# Altium schematic sheet DSI.SchDoc
size A4
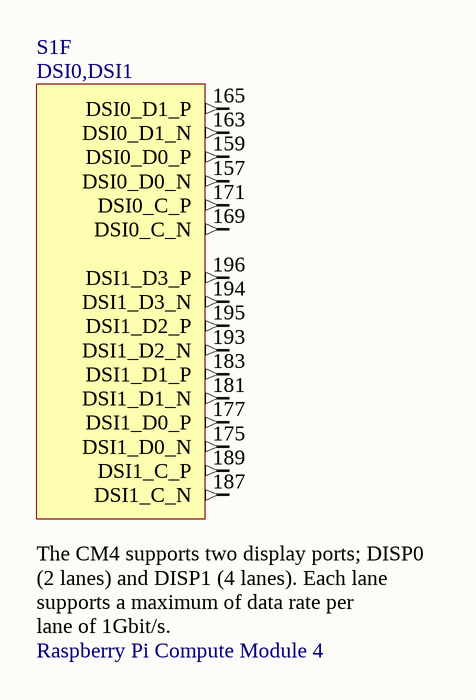
[diagram p0: DSI.SchDoc]

## Parts
S1  Raspberry Pi Compute Module 4  [CM4-F40C-100DS-0.4v_1.5mm_0mm]  (part F of 21)

## Nets

Not connected (* = marked no-connect by the designer): S1 157(DSI0_D0_N) 159(DSI0_D0_P) 163(DSI0_D1_N) 165(DSI0_D1_P) 169(DSI0_C_N) 171(DSI0_C_P) 175(DSI1_D0_N) 177(DSI1_D0_P) 181(DSI1_D1_N) 183(DSI1_D1_P) 187(DSI1_C_N) 189(DSI1_C_P) 193(DSI1_D2_N) 194(DSI1_D3_N) 195(DSI1_D2_P) 196(DSI1_D3_P)

## Notes on the sheet
- Title
- Size:
- Date:
- A4
- Number:
- Time:
- Revision:
- Sheet
- of
- Q-Wave Systems Co.,Ltd
- 65/2 Moo 1 Beung
- Sriracha Chonburi
- Thailand
- File:
- (in symbol CM4, part F) DSI0,DSI1; The CM4 supports two display ports; DISP0 (2 lanes) and DISP1 (4 lanes). Each lane supports a maximum of data rate per / lane of 1Gbit/s.

## Library data of the parts
S1 = CM4: Raspberry Pi Compute Module 4 by Amornthep Phunsin